# EasyEDA Pro project ProProject_无刷驱动板_2024-07-07.epro

# Schematic Schematic1
Create Date: 2024-04-09; Page Name: P1; Project Name: 无刷驱动板; Schematic Name: Schematic1; Update Date: 2024-05-08; Company: 嘉立创EDA; Page Size: A4; Version: V1.0
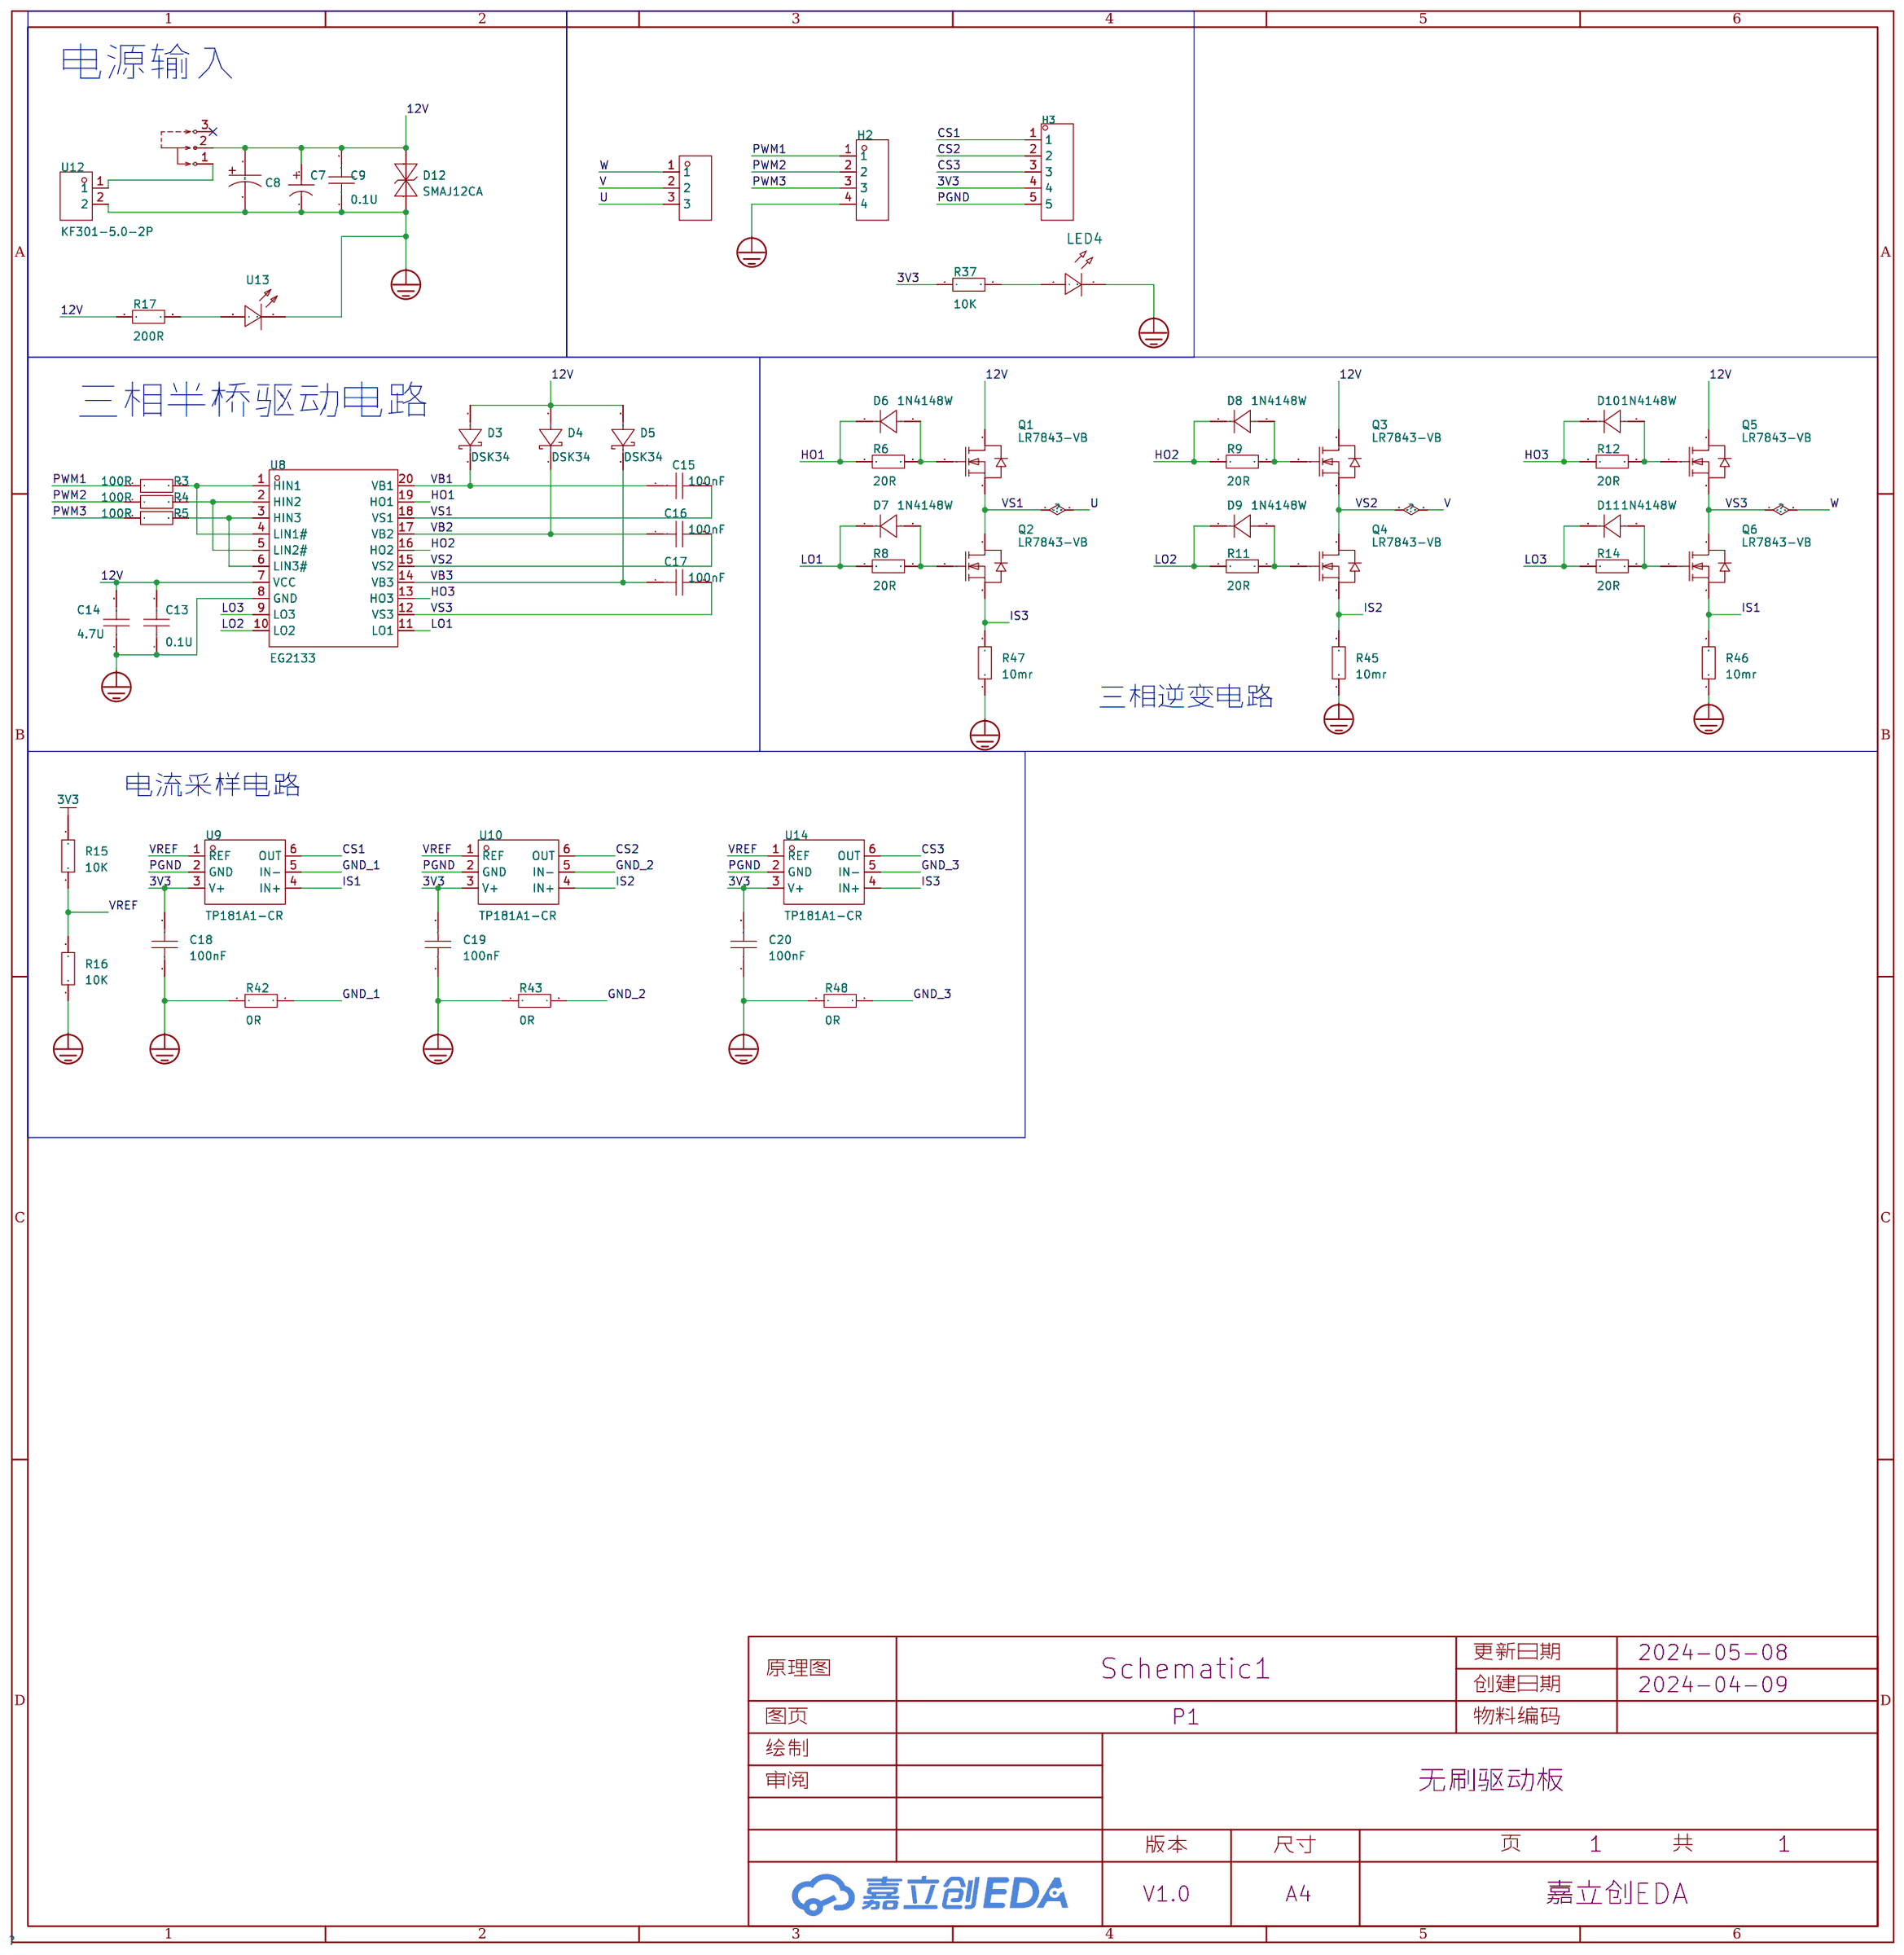
[diagram p0: schematic sheet]

## Parts
C7  100nF  [footprint_92cf]
C8  电解电容47UF  [footprint_34de]
C9  0.1U  [C0603]
C13  0.1U  [C0603]
C14  4.7U  [C0603]
C15  100nF  [C0603]
C16  100nF  [C0603]
C17  100nF  [C0603]
C18  100nF  [C0603]
C19  100nF  [C0603]
C20  100nF  [C0603]
D3  DSK34  [SOD-123FL_L2.7-W1.8-LS3.8-RD]
D4  DSK34  [SOD-123FL_L2.7-W1.8-LS3.8-RD]
D5  DSK34  [SOD-123FL_L2.7-W1.8-LS3.8-RD]
D6  1N4148W  [SOD-123_L2.8-W1.8-LS3.7-RD-1]
D7  1N4148W  [SOD-123_L2.8-W1.8-LS3.7-RD-1]
D8  1N4148W  [SOD-123_L2.8-W1.8-LS3.7-RD-1]
D9  1N4148W  [SOD-123_L2.8-W1.8-LS3.7-RD-1]
D10  1N4148W  [SOD-123_L2.8-W1.8-LS3.7-RD-1]
D11  1N4148W  [SOD-123_L2.8-W1.8-LS3.7-RD-1]
D12  SMAJ12CA  [SMA_L4.2-W2.7-LS5.0-BI]
H2  -  [HDR-TH_4P-P2.54-V-M]
H3  -  [HDR-TH_5P-P2.54-V-M]
LED4  -  [LED_0603]
Q1  LR7843-VB  [TO-252-2_L6.6-W6.1-P4.58-LS9.9-BR]
Q2  LR7843-VB  [TO-252-2_L6.6-W6.1-P4.58-LS9.9-BR]
Q3  LR7843-VB  [TO-252-2_L6.6-W6.1-P4.58-LS9.9-BR]
Q4  LR7843-VB  [TO-252-2_L6.6-W6.1-P4.58-LS9.9-BR]
Q5  LR7843-VB  [TO-252-2_L6.6-W6.1-P4.58-LS9.9-BR]
Q6  LR7843-VB  [TO-252-2_L6.6-W6.1-P4.58-LS9.9-BR]
R3  100R  [R0603]
R4  100R  [R0603]
R5  100R  [R0603]
R6  20R  [R0603]
R8  20R  [R0603]
R9  20R  [R0603]
R11  20R  [R0603]
R12  20R  [R0603]
R14  20R  [R0603]
R15  10K  [R0603]
R16  10K  [R0603]
R17  200R  [R0805]
R37  10K  [R0603]
R42  0R  [R0805]
R43  0R  [R0805]
R45  10mr  [R1206]
R46  10mr  [R1206]
R47  10mr  [R1206]
R48  0R  [R0805]
U7  HX SS12D10G4  [footprint_a0a6]
U8  EG2133  [TSSOP-20_L6.5-W4.4-P0.65-LS6.4-BL]
U9  TP181A1-CR  [SC70-6_L2.1-W1.3-P0.65-LS2.3-BL]
U10  TP181A1-CR  [SC70-6_L2.1-W1.3-P0.65-LS2.3-BL]
U11  KF301-5.0-3P  [CONN-TH_3P-P5.00_KF301-5.0-3P]
U12  KF301-5.0-2P  [CONN-TH_P5.00_KF301-5.0-2P]
U13  -  [led-smd_l3.5-w2.8-r-fd-white]
U14  TP181A1-CR  [SC70-6_L2.1-W1.3-P0.65-LS2.3-BL]

## Library data of the parts
C7 = 100nF: Supplier: LCSC; Manufacturer: ValuePro; Manufacturer Part: 0.1uF 50V 4*7; Supplier Part: C45664
C8 = 电解电容47UF
C9 C13-C20 = CAP_0603: Supplier Footprint: 0603
D3-D5 = DSK34_C727076: 二极管配置:独立式;正向压降(Vf):520mV@3A;直流反向耐压(Vr):40V;平均整流电流(Io):3A;; LCSC Part Name: 电压:40V 电流:3A; Supplier Part: C727076; Manufacturer: TWGMC(台湾迪嘉); Supplier Footprint: SOD-123FL; JLCPCB Part Class: 扩展库; Datasheet: https://atta.szlcsc.com/upload/public/pdf/source/20200828/C727076_B37FCA1E25E95F22A97D5A5D18D72E25.pdf; Supplier: LCSC; Diode Configuration: 独立式; Forward Voltage (Vf@If): 520mV@3A; Reverse Voltage (Vr): 40V; Average Rectified Current (Io): 3A; Reverse Leakage Current (Ir): 500uA@40V
D6-D11 = 1N4148W_C917030: 二极管配置:独立式;正向压降(Vf):1.25V@150mA;直流反向耐压(Vr):100V;平均整流电流(Io):300mA;功率:400mW;反向恢复时间(trr):8ns;; LCSC Part Name: 电压:100V 电流:300mA; Supplier Part: C917030; Manufacturer: JSMSEMI(杰盛微); Supplier Footprint: SOD-123; JLCPCB Part Class: 扩展库; Datasheet: https://atta.szlcsc.com/upload/public/pdf/source/20230807/C928F35F082AC22834996B2570733516.pdf; Supplier: LCSC; Diode Configuration: 独立式; Forward Voltage (Vf@If): 1.25V@150mA; Reverse Voltage (Vr): 100V; Average Rectified Current (Io): 300mA; Power Dissipation: 400mW; Reverse Leakage Current: 1uA@75V; Reverse Recovery Time (trr): 8ns; Operating Temperature: -55℃~+150℃@(Tj)
D12 = SMAJ12CA_C908818: 反向截止电压(Vrwm):12V;最大钳位电压:19.9V;峰值脉冲电流(Ipp)@10/1000us:20.1A;击穿电压:13.3V;; LCSC Part Name: 双向TVS 12V截止 20.1A峰值脉冲; Supplier Part: C908818; Manufacturer: GOODWORK(固得沃克); Supplier Footprint: SMA(DO-214AC); JLCPCB Part Class: 扩展库; Datasheet: https://atta.szlcsc.com/upload/public/pdf/source/20201231/C908757_5436EAF671B686EFC2F0DD2098F0ED89.pdf; Supplier: LCSC; Reverse Stand-Off Voltage (Vrwm): 12V; Maximum Clamping Voltage: 19.9V; Peak Pulse Current (Ipp)@10/1000us: 20.1A; Breakdown Voltage: 13.3V; Reverse Leakage Current (Ir): 5uA; Type: TVS
H2 = HDR-M_2.54_1x4P: Supplier Part: C492403; Supplier Footprint: 插件
H3 = HDR-M_2.54_1x5P: Supplier Part: C358687; Supplier Footprint: 插件
LED4 = LED_0603-R: Supplier Footprint: 0603
Q1-Q6 = LR7843-VB: 类型:N沟道;漏源电压(Vdss):30V;连续漏极电流(Id):120A;导通电阻(RDS(on)@Vgs,Id):2.3mΩ@10V,120A;; LCSC Part Name: N沟道 耐压:30V 电流:120A; Supplier Part: C5137375; Manufacturer: VBsemi(微碧半导体); Supplier Footprint: TO-252; JLCPCB Part Class: 扩展库; Datasheet: https://atta.szlcsc.com/upload/public/pdf/source/20230505/168126473CAC651DFC47C090452CBF08.pdf; Supplier: LCSC; Type: N沟道; Drain Source Voltage (Vdss): 30V; Continuous Drain Current (Id): 120A; Drain Source On Resistance (RDS(on)@Vgs,Id): 2.3mΩ@10V,120A
R3-R6 R8 R9 R11 R12 R14-R16 R37 = Res_0603: Supplier Footprint: 0603
R17 R42 R43 R48 = Res_0805: Supplier Footprint: 0805
R45-R47 = Res_1206: Supplier Footprint: 1206
U7 = HX SS12D10G4: Supplier: LCSC; Supplier Part: C5149841; Manufacturer: hanxia(韩下); link: https://atta.szlcsc.com/upload/public/pdf/source/20220907/2020D7183ED16DD6E2B9F5A13FB144CF.pdf; JLCPCB Part Class: Extended Part
U8 = EG2133_C190343: EG2133是一款高性价比的三相半桥驱动芯片，配合六颗Nmos可以组成三相直流无刷电机驱动器。; Supplier Part: C190343; Manufacturer: EG(屹晶微); Supplier Footprint: TSSOP-20; JLCPCB Part Class: 扩展库; Datasheet: https://atta.szlcsc.com/upload/public/pdf/source/20220627/F8A393EEBF3325F22DCB485BC683267F.pdf; Supplier: LCSC
U9 U10 U14 = TP181A1-CR: Supplier Part: C2902349; Manufacturer: 3PEAK; Supplier Footprint: SC70-6; JLCPCB Part Class: 扩展库; Datasheet: https://atta.szlcsc.com/upload/public/pdf/source/20230301/6D62DABF8769A8088870FFE026FF2C6D.pdf; Supplier: LCSC
U11 = KF301-5.0-3P: 结构:1x3P;间距:5mm;颜色:蓝色;安装方式:直插;额定电流:17A;额定电压:250V;排数:1;线规 - AWG:14~22;线规 - 平方毫米:1.5;每排PIN数:3;工作温度范围:-30℃~+120℃;; LCSC Part Name: 5mm 1x3P 排数:1 每排P数:3 直插; Supplier Part: C474882; Manufacturer: KEFA(科发); Supplier Footprint: 插件,P=5mm; JLCPCB Part Class: 扩展库; Datasheet: https://atta.szlcsc.com/upload/public/pdf/source/20230317/03A5B5FC229D6F9225E8F51DA1A4E80A.pdf; Supplier: LCSC; Structure: 1x3P; Pitch: 5mm; Color: 蓝色; Mounting Style: 直插; Current Rating (Max): 17A; Voltage Rating (Max): 250V; Number of Pins: 3P; Number of Rows: 1; Wire Gauge - AWG: 14~22; Wire Gauge - mm2: 1.5; Number of PINs Per Row: 3; Operating Temperature Range: -30℃~+120℃
U12 = KF301-5.0-2P: 结构:1x2P;间距:5mm;颜色:蓝色;安装方式:直插;额定电流:17A;额定电压:250V;排数:1;线规 - AWG:14~22;线规 - 平方毫米:1.5;每排PIN数:2;工作温度范围:-30℃~+120℃;; LCSC Part Name: 5mm 1x2P 排数:1 每排P数:2 直插; Supplier Part: C474881; Manufacturer: KEFA(科发); Supplier Footprint: 插件,P=5mm; JLCPCB Part Class: 扩展库; Datasheet: https://atta.szlcsc.com/upload/public/pdf/source/20230317/03A5B5FC229D6F9225E8F51DA1A4E80A.pdf; Supplier: LCSC; Structure: 1x2P; Pitch: 5mm; Color: 蓝色; Mounting Style: 直插; Current Rating (Max): 17A; Voltage Rating (Max): 250V; Number of Pins: 2P; Number of Rows: 1; Wire Gauge - AWG: 14~22; Wire Gauge - mm2: 1.5; Number of PINs Per Row: 2; Operating Temperature Range: -30℃~+120℃
U13 = led2835: LCSC Part Name: LED2835; Supplier Part: C9900002597; Manufacturer Part: LED2835; LCSC Stock: 0; LCSC On Sale: 0; Supplier Footprint: 2835; Price: 0; JLCPCB Part Class: Extended Part; JLCPCB Stock: 0; JLCPCB On Sale: 1; Datasheet: 2021-11-27/497147W/184e61ff2eea470fa2087b84cc62277a/C28438762835白色.PDF; Supplier: LCSC

## Nets
3V3: C18.2 C19.2 C20.2 H3.4 R15.2 R37.1 U9.3(V+) U10.3(V+) U14.3(V+)
12V: C7.1 C8.1 C9.2 C13.2 C14.2 D3.2(A) D4.2(A) D5.2(A) D12.2 Q1.2(D) Q3.2(D) Q5.2(D) R17.1 U7.2 U8.7(VCC)
GND_1: R42.2 U9.5(IN-)
GND_2: R43.2 U10.5(IN-)
GND_3: R48.2 U14.5(IN-)
PGND: C7.2 C8.2 C9.1 C13.1 C14.1 C18.1 C19.1 C20.1 D12.1 H2.4 H3.5 LED4.1(C) R16.1 R42.1 R43.1 R45.1 R46.1 R47.1 R48.1 U8.8(GND) U9.2(GND) U10.2(GND) U12.2 U13.1(K) U14.2(GND)
CS1: H3.1 U9.6(OUT)
CS2: H3.2 U10.6(OUT)
CS3: H3.3 U14.6(OUT)
HO1: D6.1(C) R6.1 U8.19(HO1)
HO2: D8.1(C) R9.1 U8.16(HO2)
HO3: D10.1(C) R12.1 U8.13(HO3)
IS1: Q6.3(S) R46.2 U9.4(IN+)
IS2: Q4.3(S) R45.2 U10.4(IN+)
IS3: Q2.3(S) R47.2 U14.4(IN+)
LO1: D7.1(C) R8.1 U8.11(LO1)
LO2: D9.1(C) R11.1 U8.10(LO2)
LO3: D11.1(C) R14.1 U8.9(LO3)
PWM1: H2.1 R3.1
PWM2: H2.2 R4.1
PWM3: H2.3 R5.1
U: C15.2 Q1.3(S) Q2.2(D) U8.18(VS1) U11.3
V: C16.2 Q3.3(S) Q4.2(D) U8.15(VS2) U11.2
VB1: C15.1 D3.1(K) U8.20(VB1)
VB2: C16.1 D4.1(K) U8.17(VB2)
VB3: C17.1 D5.1(K) U8.14(VB3)
VREF: R15.1 R16.2 U9.1(REF) U10.1(REF) U14.1(REF)
VS3: C17.2 Q5.3(S) Q6.2(D) U8.12(VS3) U11.1
$1N1156: R3.2 U8.1(HIN1) U8.4(LIN1#)
$1N1165: R4.2 U8.2(HIN2) U8.5(LIN2#)
$1N1174: R5.2 U8.3(HIN3) U8.6(LIN3#)
$1N1778: D6.2(A) Q1.1(G) R6.2
$1N1946: D7.2(A) Q2.1(G) R8.2
$1N2262: D8.2(A) Q3.1(G) R9.2
$1N2276: D9.2(A) Q4.1(G) R11.2
$1N2545: D10.2(A) Q5.1(G) R12.2
$1N2559: D11.2(A) Q6.1(G) R14.2
$1N8860: R17.2 U13.2(A)
$1N8883: U7.1 U12.1
$1N12779: LED4.2(A) R37.2

Not connected (* = marked no-connect by the designer): U7 3*

## Notes on the sheet
- 电源输入
- 三相半桥驱动电路
- 三相逆变电路
- 电流采样电路

# Board PCB1
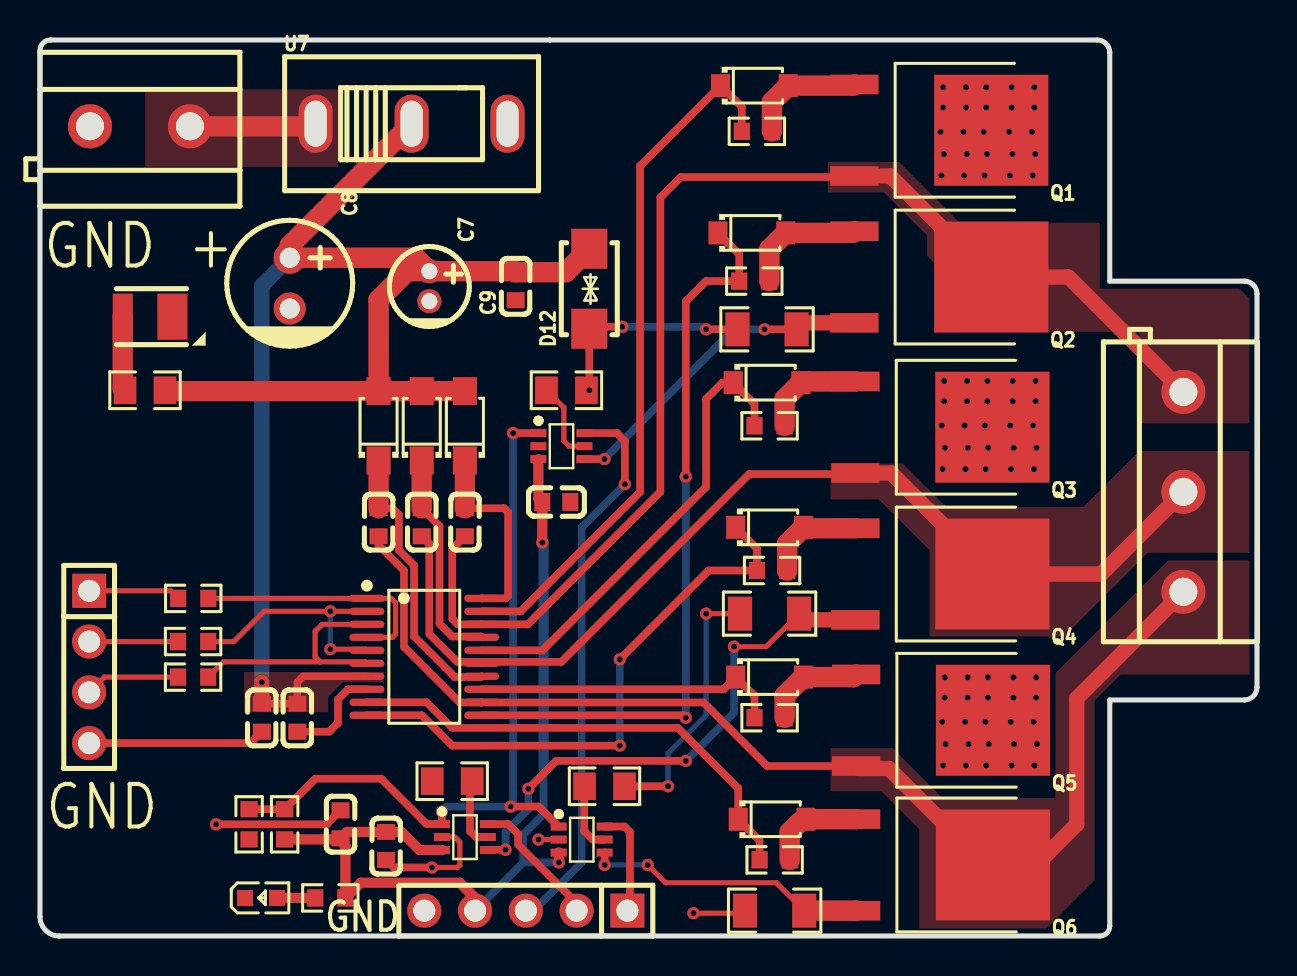
[diagram p1: board, top side]
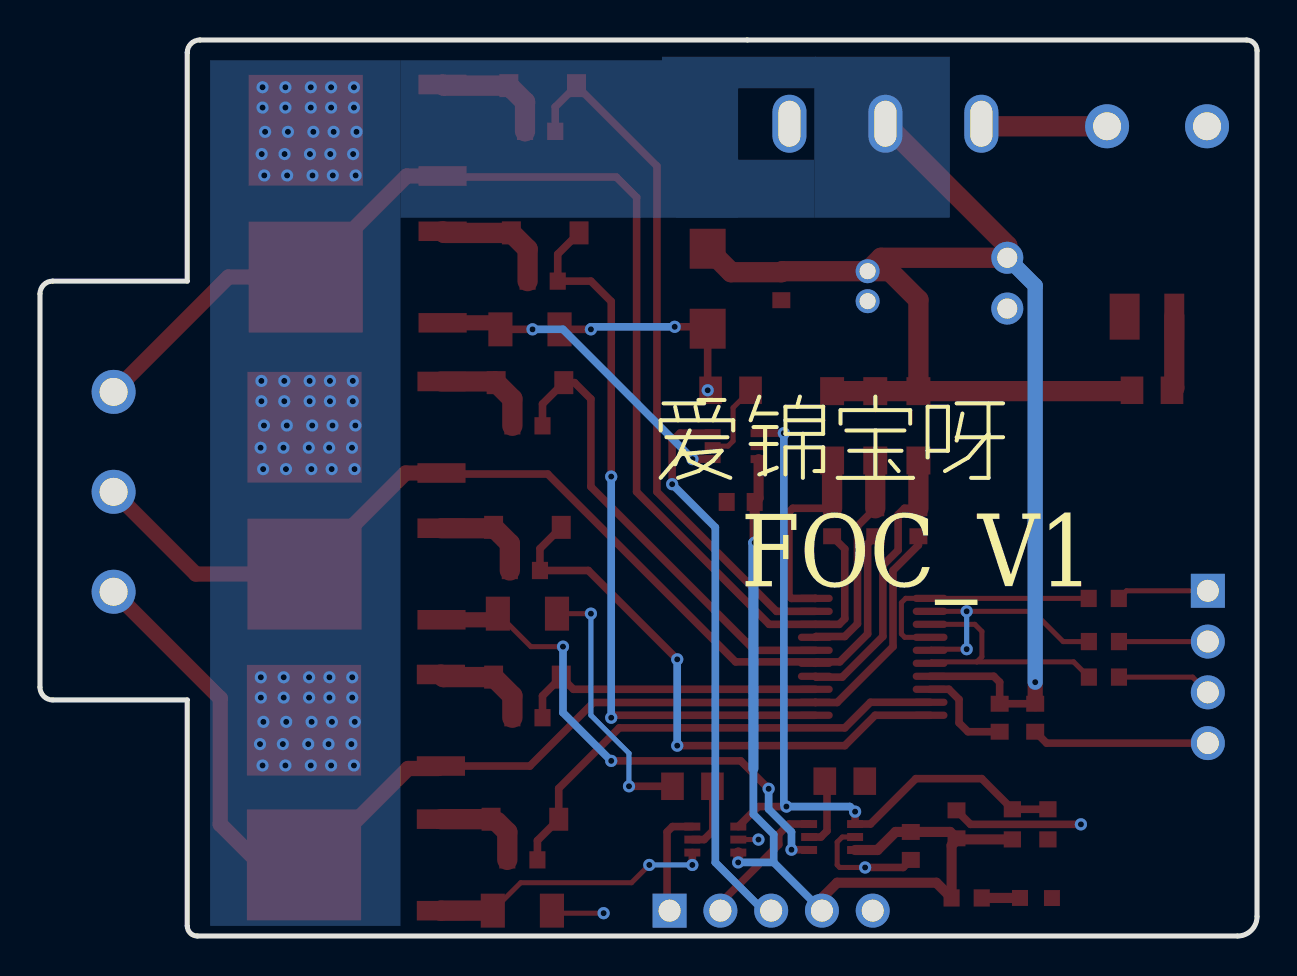
[diagram p2: board, bottom side, seen from below]

Outline 60.88 x 44.83 mm; copper layers: Top Layer, Bottom Layer. Coordinates in mm from the lower left corner of the outline.
Outline path: 0,44.3 0,0.97 arc(0.28,0.28) 0.97,0 53.01,0 arc(53.37,0.15) 53.51,0.51 53.51,11.81 60.24,11.81 arc(60.69,12) 60.88,12.45 60.88,32.13 arc(60.69,32.58) 60.24,32.77 53.51,32.77 53.51,44.2 arc(53.33,44.65) 52.88,44.83 0.53,44.83 arc(0.16,44.68) 0,44.3
Stack: Top Layer 0.035mm / Dielectric1 1.51mm FR4 er 4.5 / Bottom Layer 0.035mm

## Design rules (mm)
template: JLCPCB Capability(Two Layers Board)
spacing copperThickness1oz (default): track to track 0.102, other pairs 0.152 to 0.3
spacing copperThickness2oz: track to track 0.203, other pairs 0.152 to 0.3
track width copperThickness1oz (default): min 0.127, default 0.254, max 2.54
track width copperThickness2oz: min 0.203, default 0.254, max 2.54
differential pair differentialPair (default): width min 0.127, default 0.254, max 2.54; gap min 0.152, default 0.152
via viaSize (default): diameter min 0.5, default 0.61, max 10; hole min 0.3, default 0.305, max 6.3

## Placement (name value [footprint] x y rotation side)
C7  100nF  [footprint_92cf]  19.48 32.51 270 top
C8  电解电容47UF  [footprint_34de]  11.35 32.51 270 top
C9  0.1U  [C0603]  23.8 32.51 90 top
C13  0.1U  [C0603]  12.87 10.92 90 top
C14  4.7U  [C0603]  11.1 10.92 90 top
C15  100nF  [C0603]  21.26 20.7 270 top
C16  100nF  [C0603]  19.1 20.7 270 top
C17  100nF  [C0603]  16.94 20.7 270 top
C18  100nF  [C0603]  15.03 5.59 270 top
C19  100nF  [C0603]  17.32 4.51 90 top
C20  100nF  [C0603]  25.83 21.72 180 top
D3  DSK34  [SOD-123FL_L2.7-W1.8-LS3.8-RD]  21.26 25.53 90 top
D4  DSK34  [SOD-123FL_L2.7-W1.8-LS3.8-RD]  19.1 25.53 90 top
D5  DSK34  [SOD-123FL_L2.7-W1.8-LS3.8-RD]  16.94 25.53 90 top
D6  1N4148W  [SOD-123_L2.8-W1.8-LS3.7-RD-1]  35.73 42.55 0 top
D7  1N4148W  [SOD-123_L2.8-W1.8-LS3.7-RD-1]  35.61 35.18 0 top
D8  1N4148W  [SOD-123_L2.8-W1.8-LS3.7-RD-1]  36.37 27.69 0 top
D9  1N4148W  [SOD-123_L2.8-W1.8-LS3.7-RD-1]  36.5 20.45 0 top
D10  1N4148W  [SOD-123_L2.8-W1.8-LS3.7-RD-1]  36.5 12.95 0 top
D11  1N4148W  [SOD-123_L2.8-W1.8-LS3.7-RD-1]  36.62 5.84 0 top
D12  SMAJ12CA  [SMA_L4.2-W2.7-LS5.0-BI]  27.48 32.39 90 top
H2  -  [HDR-TH_4P-P2.54-V-M]  2.46 13.46 270 top
H3  -  [HDR-TH_5P-P2.54-V-M]  24.3 1.27 180 top
LED4  -  [LED_0603]  11.11 1.91 0 top
Q1  LR7843-VB  [TO-252-2_L6.6-W6.1-P4.58-LS9.9-BR]  44.16 40.32 180 top
Q2  LR7843-VB  [TO-252-2_L6.6-W6.1-P4.58-LS9.9-BR]  44.16 32.97 180 top
Q3  LR7843-VB  [TO-252-2_L6.6-W6.1-P4.58-LS9.9-BR]  44.22 25.46 180 top
Q4  LR7843-VB  [TO-252-2_L6.6-W6.1-P4.58-LS9.9-BR]  44.22 18.11 180 top
Q5  LR7843-VB  [TO-252-2_L6.6-W6.1-P4.58-LS9.9-BR]  44.25 10.8 180 top
Q6  LR7843-VB  [TO-252-2_L6.6-W6.1-P4.58-LS9.9-BR]  44.25 3.56 180 top
R3  100R  [R0603]  7.67 16.89 0 top
R4  100R  [R0603]  7.66 14.73 0 top
R5  100R  [R0603]  7.66 12.95 0 top
R6  20R  [R0603]  35.86 40.26 0 top
R8  20R  [R0603]  35.73 32.77 0 top
R9  20R  [R0603]  36.5 25.53 0 top
R11  20R  [R0603]  36.62 18.29 0 top
R12  20R  [R0603]  36.5 10.92 0 top
R14  20R  [R0603]  36.75 3.81 0 top
R15  10K  [R0603]  12.24 5.59 270 top
R16  10K  [R0603]  10.46 5.59 90 top
R17  200R  [R0805]  5.25 27.31 180 top
R37  10K  [R0603]  14.52 1.91 180 top
R42  0R  [R0805]  28.24 7.49 180 top
R43  0R  [R0805]  20.62 7.75 0 top
R45  10mr  [R1206]  36.5 16.13 0 top
R46  10mr  [R1206]  36.75 1.27 0 top
R47  10mr  [R1206]  36.37 30.35 0 top
R48  0R  [R0805]  26.34 27.31 180 top
U7  HX SS12D10G4  [footprint_a0a6]  18.59 40.64 0 top
U8  EG2133  [TSSOP-20_L6.5-W4.4-P0.65-LS6.4-BL]  19.22 13.97 270 top
U9  TP181A1-CR  [SC70-6_L2.1-W1.3-P0.65-LS2.3-BL]  27.1 4.83 270 top
U10  TP181A1-CR  [SC70-6_L2.1-W1.3-P0.65-LS2.3-BL]  21.26 4.95 270 top
U11  KF301-5.0-3P  [CONN-TH_3P-P5.00_KF301-5.0-3P]  57.2 22.23 90 top
U12  KF301-5.0-2P  [CONN-TH_P5.00_KF301-5.0-2P]  5 40.51 180 top
U13  -  [led-smd_l3.5-w2.8-r-fd-white]  5.25 30.99 0 top
U14  TP181A1-CR  [SC70-6_L2.1-W1.3-P0.65-LS2.3-BL]  26.08 24.51 270 top

## Footprints (pads in the part's own frame, mm; a bottom-side part is the same pattern mirrored in y, then rotated)
C0603
  rect 0.8x0.9 smd: 1(-0.7,0) 2(0.7,0)
CONN-TH_3P-P5.00_KF301-5.0-3P
  round 2.2 hole 1.4: 1(-5,0) 2(0,0) 3(5,0)
CONN-TH_P5.00_KF301-5.0-2P
  round 2.2 hole 1.4: 1(-2.5,0) 2(2.5,0)
footprint_34de
  round 1.6 hole 1.005x1: 1(-1.422,1.143) 2(1.118,1.143)
footprint_92cf
  round 1.2 hole 0.8: 1(-0.75,0) 2(0.75,0)
footprint_a0a6
  oval 1.7x2.9 hole 1.1x2.3: 1(-4.8,0) 2(0.001,0) 3(4.8,0)
HDR-TH_4P-P2.54-V-M
  rect 1.7x1.7 hole 1.1: 1(-3.81,0)
  round 1.7 hole 1.1: 2(-1.27,0) 3(1.27,0) 4(3.81,0)
HDR-TH_5P-P2.54-V-M
  rect 1.7x1.7 hole 1.1: 1(-5.08,0)
  round 1.7 hole 1.1: 2(-2.54,0) 3(0,0) 4(2.54,0) 5(5.08,0)
led-smd_l3.5-w2.8-r-fd-white
  rect 1.5x2.301 smd: 1(1.369,0)
  rect 1x2.301 smd: 2(-1.115,0)
LED_0603
  rect 0.8x0.8 smd: 1(-0.851,-0.01) 2(0.75,-0.005)
R0603
  rect 0.806x0.864 smd: 1(-0.753,0) 2(0.753,0)
R0805
  rect 1.133x1.377 smd: 1(-1,0) 2(1,0)
R1206
  rect 1.208x1.701 smd: 1(-1.479,0) 2(1.479,0)
SC70-6_L2.1-W1.3-P0.65-LS2.3-BL
  rect 0.4x0.8 smd: 1(-0.65,-1.15) 2(-0.001,-1.15) 3(0.65,-1.15) 4(0.65,1.15) 5(0,1.15) 6(-0.65,1.15)
SMA_L4.2-W2.7-LS5.0-BI
  rect 2x1.8 smd: 1(-2,0) 2(2,0)
SOD-123_L2.8-W1.8-LS3.7-RD-1
  rect 0.95x1.15 smd: 1(-1.692,0) 2(1.692,0)
SOD-123FL_L2.7-W1.8-LS3.8-RD
  rect 1.4x1.2 smd: 1(-1.735,0) 2(1.735,0)
TO-252-2_L6.6-W6.1-P4.58-LS9.9-BR
  rect 2.409x0.979 smd: 1(3.424,-2.29) 3(3.424,2.29)
  rect 5.711x5.548 smd: 2(-3.424,0)
TSSOP-20_L6.5-W4.4-P0.65-LS6.4-BL
  oval 0.364x1.742 smd: 1(-2.925,-2.871) 2(-2.275,-2.871) 3(-1.625,-2.871) 4(-0.975,-2.871) 5(-0.325,-2.871) 6(0.325,-2.871) 7(0.975,-2.871) 8(1.625,-2.871) 9(2.275,-2.871) 10(2.925,-2.871) 11(2.925,2.871) 12(2.275,2.871) 13(1.625,2.871) 14(0.975,2.871) 15(0.325,2.871) 16(-0.325,2.871) 17(-0.975,2.871) 18(-1.625,2.871) 19(-2.275,2.871) 20(-2.925,2.871)

## Nets
As in the schematic.

Pads without a net: U7 3

## Via types
v1: diameter 0.61, hole 0.305, Top Layer to Bottom Layer, 105 vias

## Routing (per net, layer and track width the routed paths; a pad name or vN(x,y) marks a point on that pad's centre or on a via; arc(x,y) is an arc through that point)
3V3: length 45.6
  Top Layer w0.508: 14.98,4.83 C18.2 15.35,5.21 C19.2 18.08,5.21 18.98,4.3 U10.3 ; 14.98,4.83 15.28,4.54 R37.1 16.04,2.67 21,2.67 21.76,1.91 H3.4 ; 14.98,4.83 R15.2 ; U14.3 24.93,21.91 C20.2 v1(25.13,19.69) ; v1(25.95,3.68) 25.95,4.17 U9.3
  Bottom Layer w0.381: 25.19,8.38 25.19,6.1 24.18,5.08 24.18,3.68 ; 24.18,3.68 H3.4 ; 24.18,3.68 v1(25.95,3.68)
  Bottom Layer w0.508: 25.19,8.38 25.19,19.69 v1(25.13,19.69)
12V: length 77.1
  Top Layer w0.381: U8.7 13.17,13 12.87,12.7 C13.2 C14.2
  Top Layer w0.762: C14.2 v1(11.1,12.7)
  Top Layer w1.016: D12.2 26.31,33.21 C9.2 23.75,33.26 C7.1 ; D5.2 D4.2 D3.2 ; D5.2 6.3,27.26 R17.1 ; D5.2 16.94,31.83 18.37,33.26 C7.1 ; C7.1 18.81,33.93 C8.1 12.49,34.54 U7.2
  Bottom Layer w0.762: v1(11.1,12.7) 11.1,32.54 C8.1
  vias: v1(45.05,40.23) v1(45.09,38.05) v1(45.1,25.54) v1(45.17,42.47) v1(45.17,41.45) v1(45.22,39.12) v1(45.15,23.36) v1(45.13,10.72) v1(45.17,8.53) v1(45.23,27.77) v1(45.23,26.76) v1(45.27,24.43) v1(45.26,12.95) v1(45.26,11.93) v1(45.3,9.6) v1(46.19,40.23) v1(46.32,42.47) v1(46.32,41.45) v1(46.23,38.05) v1(46.25,25.54) v1(46.29,23.36) v1(46.28,10.72) v1(46.32,8.53) v1(46.36,39.12) v1(46.37,27.77) v1(46.37,26.76) v1(46.42,24.43) v1(46.4,12.95) v1(46.4,11.93) v1(46.45,9.6) v1(47.21,40.23) v1(47.25,38.05) v1(47.26,25.54) v1(47.3,23.36) v1(47.29,10.72) v1(47.33,42.47) v1(47.33,41.45) v1(47.38,39.12) v1(47.39,27.77) v1(47.39,26.76) v1(47.33,8.53) v1(47.43,24.43) v1(47.42,12.95) v1(47.42,11.93) v1(47.46,9.6) v1(48.48,40.23) v1(48.52,38.05) v1(48.6,42.47) v1(48.6,41.45) v1(48.53,25.54) v1(48.57,23.36) v1(48.56,10.72) v1(48.6,8.53) v1(48.64,39.12) v1(48.66,27.77) v1(48.66,26.76) v1(48.7,24.43) v1(48.69,12.95) v1(48.69,11.93) v1(48.73,9.6) v1(49.62,40.23) v1(49.66,38.05) v1(49.68,25.54) v1(49.72,23.36) v1(49.71,10.72) v1(49.75,42.47) v1(49.75,41.45) v1(49.79,39.12) v1(49.8,27.77) v1(49.8,26.76) v1(49.75,8.53) v1(49.84,24.43) v1(49.83,12.95) v1(49.83,11.93) v1(49.87,9.6)
GND_1: length 3.4
  Top Layer w0.381: U9.5 27.66,4.83 27.23,5.26 27.23,7.48 R42.2
GND_2: length 3.6
  Top Layer w0.381: R43.2 21.51,7.64 21.51,5.26 21.82,4.95 22.41,4.95
GND_3: length 4
  Top Layer w0.254: U14.5 26.46,24.51 26.21,24.77 26.21,26.43 R48.2
PGND: length 54.1
  Top Layer w0.254: U9.2 v1(24.94,4.83) ; v1(32.69,1.14) 35.14,1.14 R46.1 ; U10.2 20.75,4.95 21,4.7 21,3.56 20.88,3.43 v1(19.61,3.43) ; v1(33.32,16.13) R45.1
  Top Layer w0.381: v1(29.13,30.48) 27.57,30.48 D12.1 v1(27.48,27.31) ; U8.8 15.41,12.34 14.91,11.84 14.91,10.67 14.46,10.22 C13.1 ; v1(19.61,3.43) 17.7,3.43 C19.1 ; C18.1 14.33,5.59 v1(8.81,5.59) ; R42.1 v1(31.42,7.49) ; C14.1 10.53,9.65 H2.4 ; R47.1 v1(33.32,30.35)
  Bottom Layer w0.254: v1(31.42,7.49) 31.42,9.14 33.32,11.05 v1(33.32,16.13)
  Bottom Layer w0.381: v1(29.13,30.48) 33.32,30.48 v1(33.32,30.35)
CS1: length 5.2
  Top Layer w0.381: 29.51,1.4 29.51,5.21 29.24,5.48 U9.6
CS2: length 6.8
  Top Layer w0.381: 22.41,5.6 23.42,5.6 23.92,5.09 23.92,4.57 26.84,1.65 H3.2
CS3: length 28
  Top Layer w0.381: v1(29.26,22.61) 29.26,24.77 28.86,25.16 U14.6
  Bottom Layer w0.381: v1(29.26,22.61) 27.1,20.45 27.1,3.68 24.69,1.27 H3.3
HO1: length 35.1
  Top Layer w0.381: U8.19 24.04,16.25 30.02,22.23 30.02,38.52 D6.1 35.11,41.48 R6.1
HO2: length 23.3
  Top Layer w0.381: U8.16 25.14,14.3 33.32,22.48 33.32,26.87 34.14,27.69 D8.1 35.74,26.62 R9.1
HO3: length 15.4
  Top Layer w0.381: U8.13 34.19,12.34 D10.1 35.74,12.02 R12.1
IS1: length 14.1
  Top Layer w0.254: v1(30.4,3.56) 31.29,2.67 36.83,2.67 R46.2
  Top Layer w0.381: U9.4 v1(28.25,3.56)
  Top Layer w1.016: R46.2 40.82,1.27 Q6.3
  Bottom Layer w0.254: v1(28.25,3.56) v1(30.4,3.56)
IS2: length 26.5
  Top Layer w0.254: R45.2 36.32,14.48 v1(34.72,14.48)
  Top Layer w0.381: v1(24.43,7.37) 25.83,8.76 v1(32.3,8.76) ; v1(23.29,4.32) 22.42,4.32 22.41,4.3
  Top Layer w0.762: R45.2 38.28,15.82 40.8,15.82
  Bottom Layer w0.381: v1(32.3,8.76) 34.72,11.18 v1(34.72,14.48) ; v1(23.29,4.32) 23.29,5.21 24.43,6.35 v1(24.43,7.37)
IS3: length 16.3
  Top Layer w0.381: v1(36.24,30.35) R47.2 ; U14.4 v1(28.24,23.86)
  Top Layer w0.762: Q2.3 38.17,30.68 R47.2
  Bottom Layer w0.381: v1(28.24,23.86) 28.24,23.88 34.72,30.35 v1(36.24,30.35)
LO1: length 37
  Top Layer w0.381: v1(32.3,22.99) 32.3,31.75 33.32,32.77 R8.1 34.98,34.11 D7.1 ; U8.11 32.18,11.05 v1(32.3,10.92)
  Bottom Layer w0.381: v1(32.3,10.92) v1(32.3,22.99)
LO2: length 28.9
  Top Layer w0.381: v1(29,13.84) 33.45,18.29 R11.1 35.87,19.38 D9.1 ; v1(29,9.53) 20.62,9.53 19.1,11.05 U8.10
  Bottom Layer w0.381: v1(29,9.53) v1(29,13.84)
LO3: length 24.4
  Top Layer w0.381: R14.1 36,4.78 D11.1 34.93,7.39 31.9,10.41 20.62,10.41 19.34,11.7 U8.9
PWM1: length 4.6
  Top Layer w0.254: R3.1 6.53,17.27 H2.1
PWM2: length 4.4
  Top Layer w0.254: R4.1 H2.2
PWM3: length 4.8
  Top Layer w0.254: H2.3 3.22,12.95 R5.1
U: length 63.5
  Top Layer w0.381: C15.2 20.62,19.37 20.62,15.88 20.9,15.59 U8.18 24.41,15.59 31.04,22.23 31.04,36.96 32.05,37.97 40.69,37.97 Q1.3
  Top Layer w0.762: Q1.3 42.53,38.03 Q2.2 51.45,32.97 U11.3
V: length 51.2
  Top Layer w0.381: C16.2 19.48,19.62 19.48,15.11 20.88,13.72 22.02,13.72 ; Q3.3 40.74,23.11 35.48,23.11 26.08,13.72 22.02,13.72 ; 22.1,13.65 22.02,13.72
  Top Layer w0.762: U11.2 53.08,18.11 Q4.2 42.59,23.17 Q3.3
VB1: length 10.2
  Top Layer w0.381: U8.20 22.1,16.89 23.29,16.89 23.42,17.02 23.42,21.21 23.22,21.4 C15.1
  Top Layer w1.016: D3.1 C15.1
VB2: length 10.9
  Top Layer w0.381: C16.1 19.99,20.51 19.99,15.62 20.62,14.99 22.05,14.99 22.1,14.95
  Top Layer w1.016: D4.1 C16.1
VB3: length 14.2
  Top Layer w0.381: U8.14 22.05,12.95 20.75,12.95 18.72,14.99 18.72,18.54 17.95,19.3 17.95,21.08 17.64,21.4 C17.1
  Top Layer w1.016: D5.1 C17.1
VREF: length 38.2
  Top Layer w0.381: R16.2 R15.1 13.77,7.87 17.07,7.87 19.34,5.6 U10.1 v1(20.11,6.22) ; v1(23.54,6.48) 24.95,6.48 U9.1 ; U14.1 v1(23.67,25.16)
  Bottom Layer w0.381: v1(23.67,25.16) 23.67,6.6 v1(23.54,6.48) 20.36,6.48 v1(20.11,6.22)
VS3: length 58.9
  Top Layer w0.381: 22.08,11.68 33.19,11.68 36.37,8.51 40.83,8.51 ; 22.08,11.68 U8.12 ; 22.08,11.68 21,11.68 18.21,14.48 18.21,18.29 16.94,19.56 C17.2
  Top Layer w0.762: 40.83,8.51 40.95,8.38 42.46,8.38 47.29,3.56 49.83,3.56 51.86,5.59 51.86,11.89 U11.1
$1N1156: length 12.5
  Top Layer w0.254: 16.35,14.95 17.62,14.95 17.79,15.11 17.79,16.68 17.57,16.9 U8.1 16.35,16.89 R3.2
$1N1165: length 12.3
  Top Layer w0.254: v1(14.52,14.35) 16.3,14.35 U8.5 ; 8.41,14.73 9.7,14.73 11.21,16.25 v1(14.52,16.25) U8.2
  Bottom Layer w0.254: v1(14.52,14.35) v1(14.52,16.25) 14.52,16.26
$1N1174: length 12.7
  Top Layer w0.254: 8.41,12.95 9.17,13.72 14.02,13.72 ; 14.02,13.72 16.28,13.72 16.35,13.65 ; 14.02,13.72 13.76,13.97 13.76,15.24 14.12,15.59 U8.3
$1N1778: length 6
  Top Layer w1.016: Q1.1 40.68,42.55 D6.2 36.61,41.73 R6.2
$1N1946: length 6.2
  Top Layer w1.016: R8.2 36.49,34.37 D7.2 40.66,35.18 Q2.1
$1N2262: length 5.3
  Top Layer w1.016: R9.2 37.25,26.87 D8.2 38.12,27.75 Q3.1
$1N2276: length 5.1
  Top Layer w1.016: R11.2 37.38,19.64 D9.2 38.23,20.4 Q4.1
$1N2545: length 5.1
  Top Layer w1.016: R12.2 37.25,12.02 D10.2 40.69,12.95 Q5.1
$1N2559: length 4.6
  Top Layer w1.016: D11.2 38.32,5.85 Q6.1 ; 38.02,5.72 37.5,5.2 R14.2
$1N8860: length 3.7
  Top Layer w1.016: U13.2 4.14,27.42 R17.2
$1N8883: length 6.4
  Top Layer w1.016: U12.1 13.66,40.51 arc(13.75,40.55) U7.1
$1N12779: length 1.9
  Top Layer w0.508: LED4.2 R37.2

## Copper pours and planes (outline as drawn; the poured copper is in the pictures)
12V on Top Layer: 10.21,13.21 17.2,13.21 17.2,11.2 10.21,11.2
12V on Bottom Layer: 42.85,43.82 52.37,43.82 52.37,0.51 42.85,0.51
12V on Bottom Layer: 25.95,43.82 42.85,43.82 42.85,35.94 25.95,35.94
12V on Bottom Layer: 22.07,43.99 29.77,43.99 29.77,42.42 22.07,42.42
12V on Bottom Layer: 22.14,38.84 29.1,38.84 29.1,35.94 22.14,35.94
12V on Bottom Layer: 15.37,43.99 22.14,43.99 22.14,35.94 15.37,35.94
PGND on Top Layer: -8.97,49.4 66.6,49.4 66.6,-6.6 -8.97,-6.6
PGND on Bottom Layer: -5.41,48.01 63.67,48.01 63.67,-4.44 -5.41,-4.44
U on Top Layer: 39.42,38.73 50.47,38.73 50.47,30.1 39.42,30.1
U on Top Layer: 48.15,35.69 60.5,35.69 60.5,25.53 48.15,25.53
V on Top Layer: 39.54,23.62 51.1,23.62 51.1,14.99 39.54,14.99
V on Top Layer: 50.47,24.27 60.5,24.27 60.5,14.86 50.47,14.86
VS3 on Top Layer: 50.34,18.8 60.5,18.8 60.5,0.38 50.34,0.38
VS3 on Top Layer: 39.54,9.4 51.23,9.4 51.23,0.38 39.54,0.38
$1N8883 on Top Layer: 5.26,42.36 14.91,42.36 14.91,38.48 5.26,38.48

## Text on the board
Bottom Silkscreen Layer: FOC_V1 | 爱锦宝呀
Top Silkscreen Layer: GND | +
